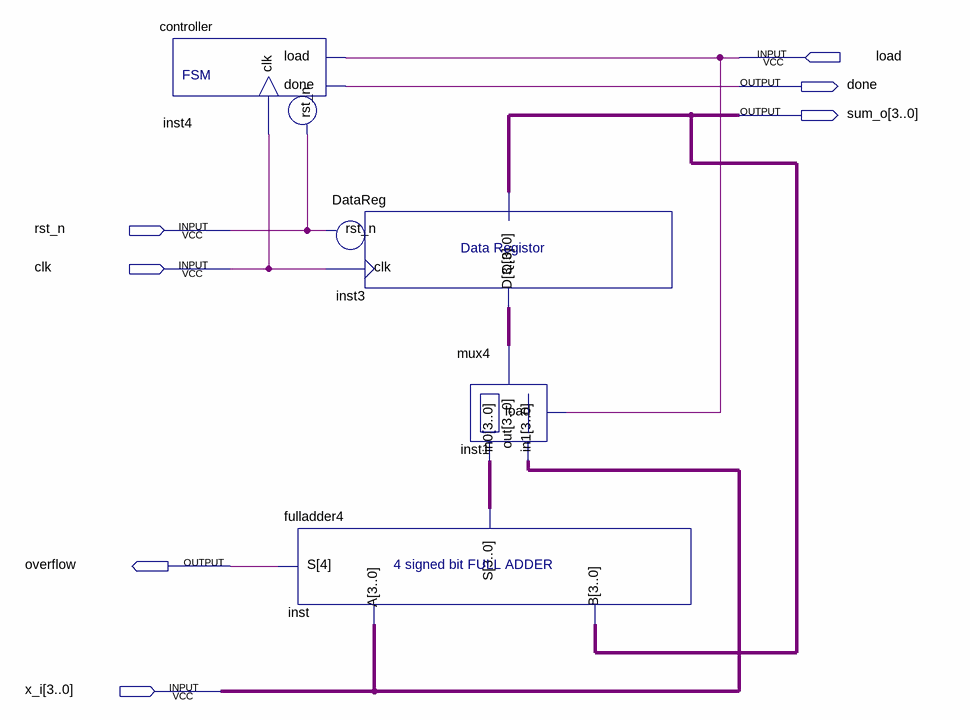
[diagram p0: schematic sheet]
// Quartus schematic AC4.bdf as structural Verilog: 4 symbols, 7 pins
module AC4 (
  input  load,
  input  rst_n,
  input  clk,
  input  [3:0] x_i,
  output done,
  output [3:0] sum_o,
  output overflow
);

  wire [3:0] inst1_out, inst_s;

  controller inst4 (.rst_n(rst_n), .clk(clk), .load(load), .done(done));
  fulladder4 inst (.A(x_i), .B(sum_o), .S({overflow, inst_s}));
  DataReg inst3 (.rst_n(rst_n), .clk(clk), .D(inst1_out), .Q(sum_o));
  mux4 inst1 (.in0(inst_s), .in1(x_i), .load(load), .out(inst1_out));
endmodule
